# Altium schematic sheet ADCS.SchDoc
size A2 portrait; SheetNumber: 1; SheetTotal: 1
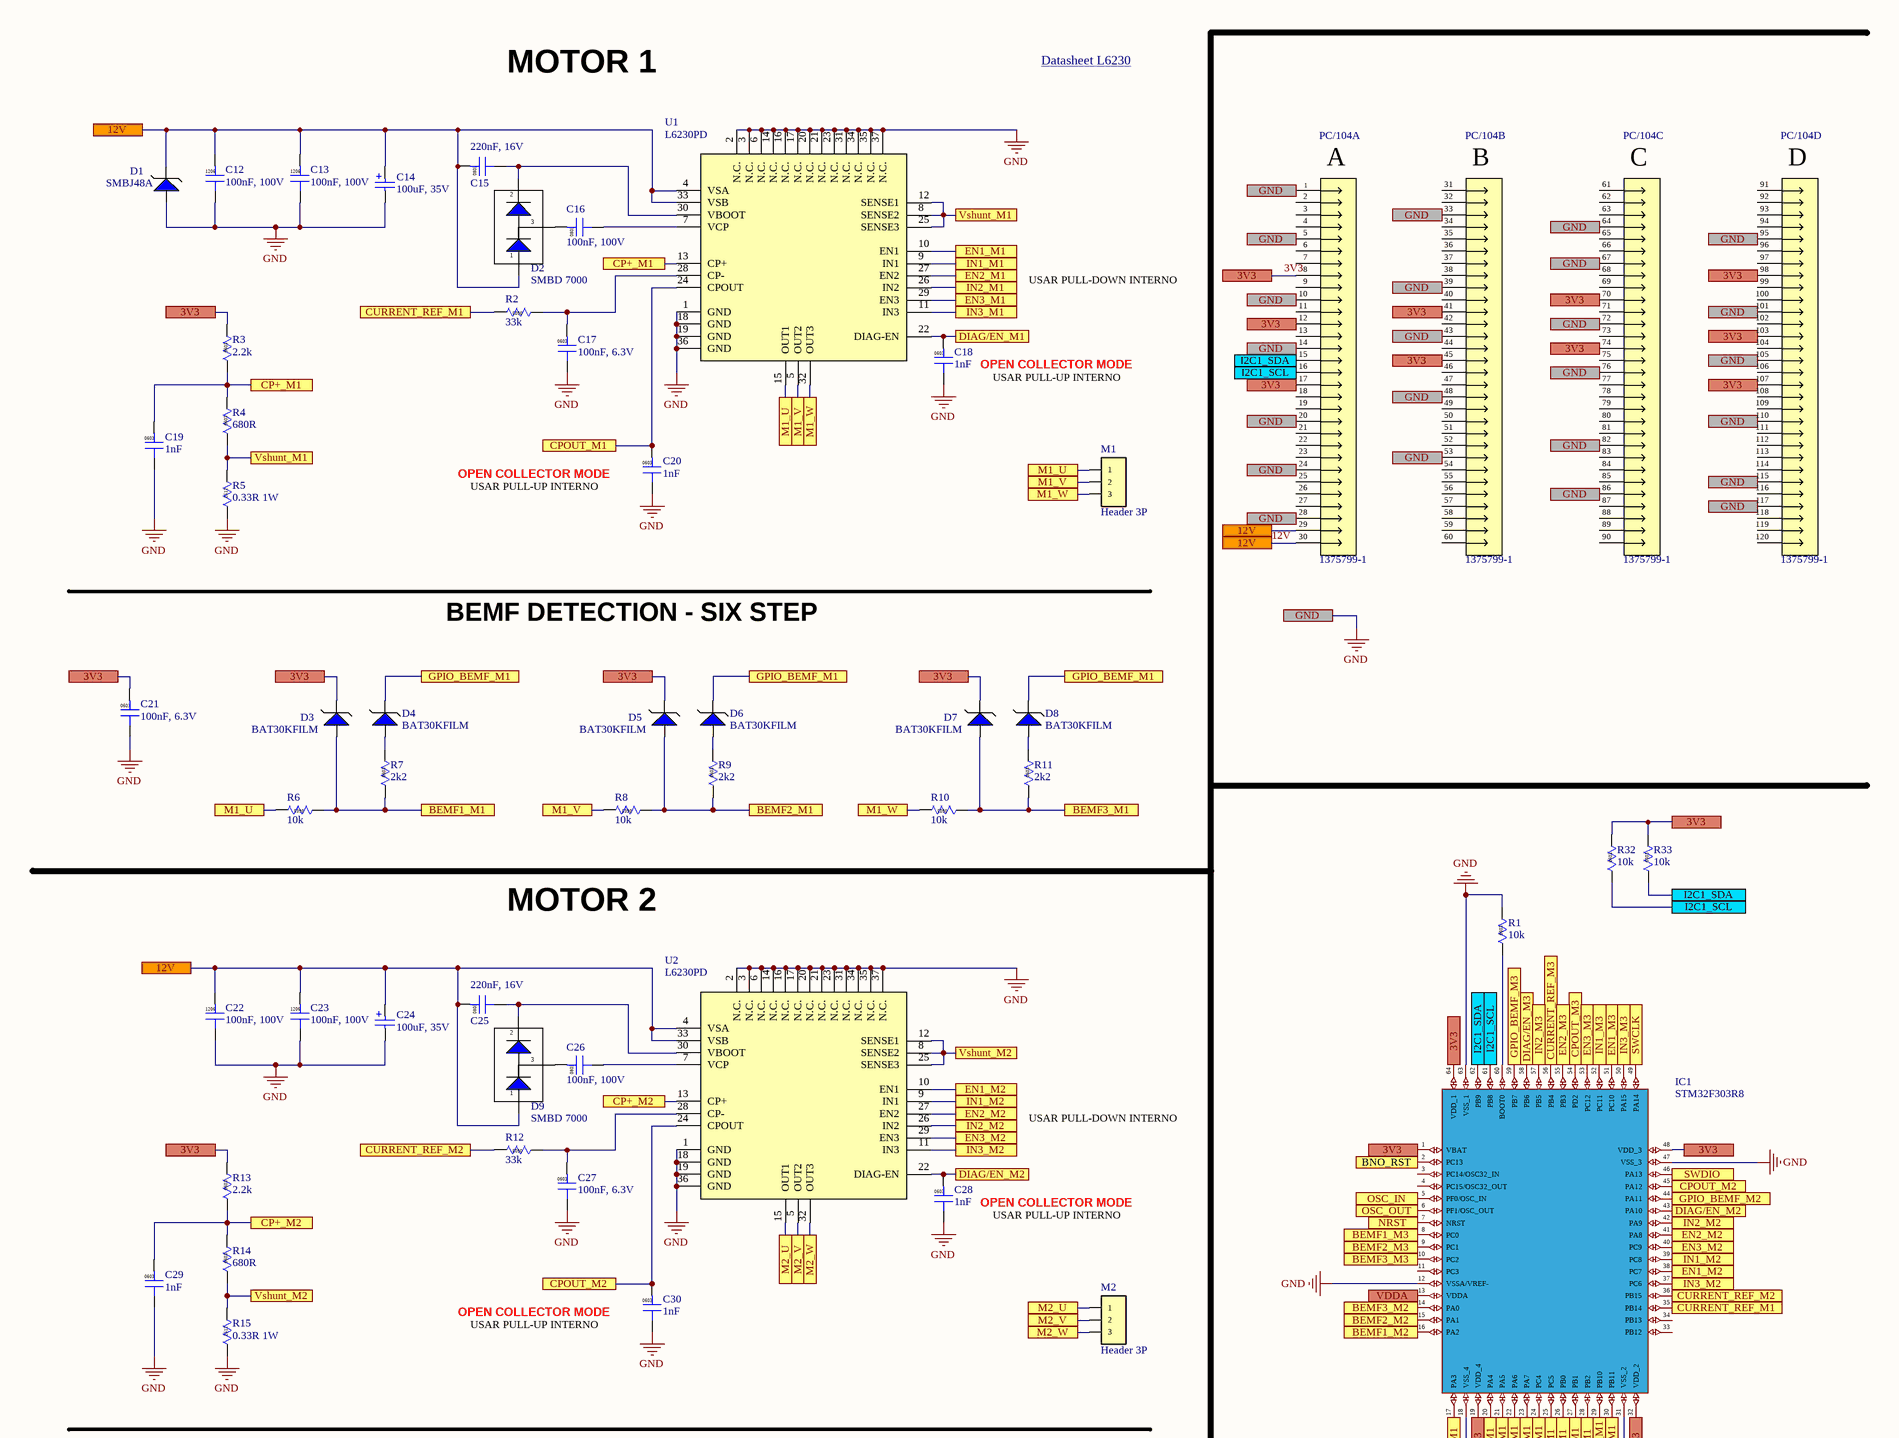
[diagram p0: ADCS.SchDoc, top]
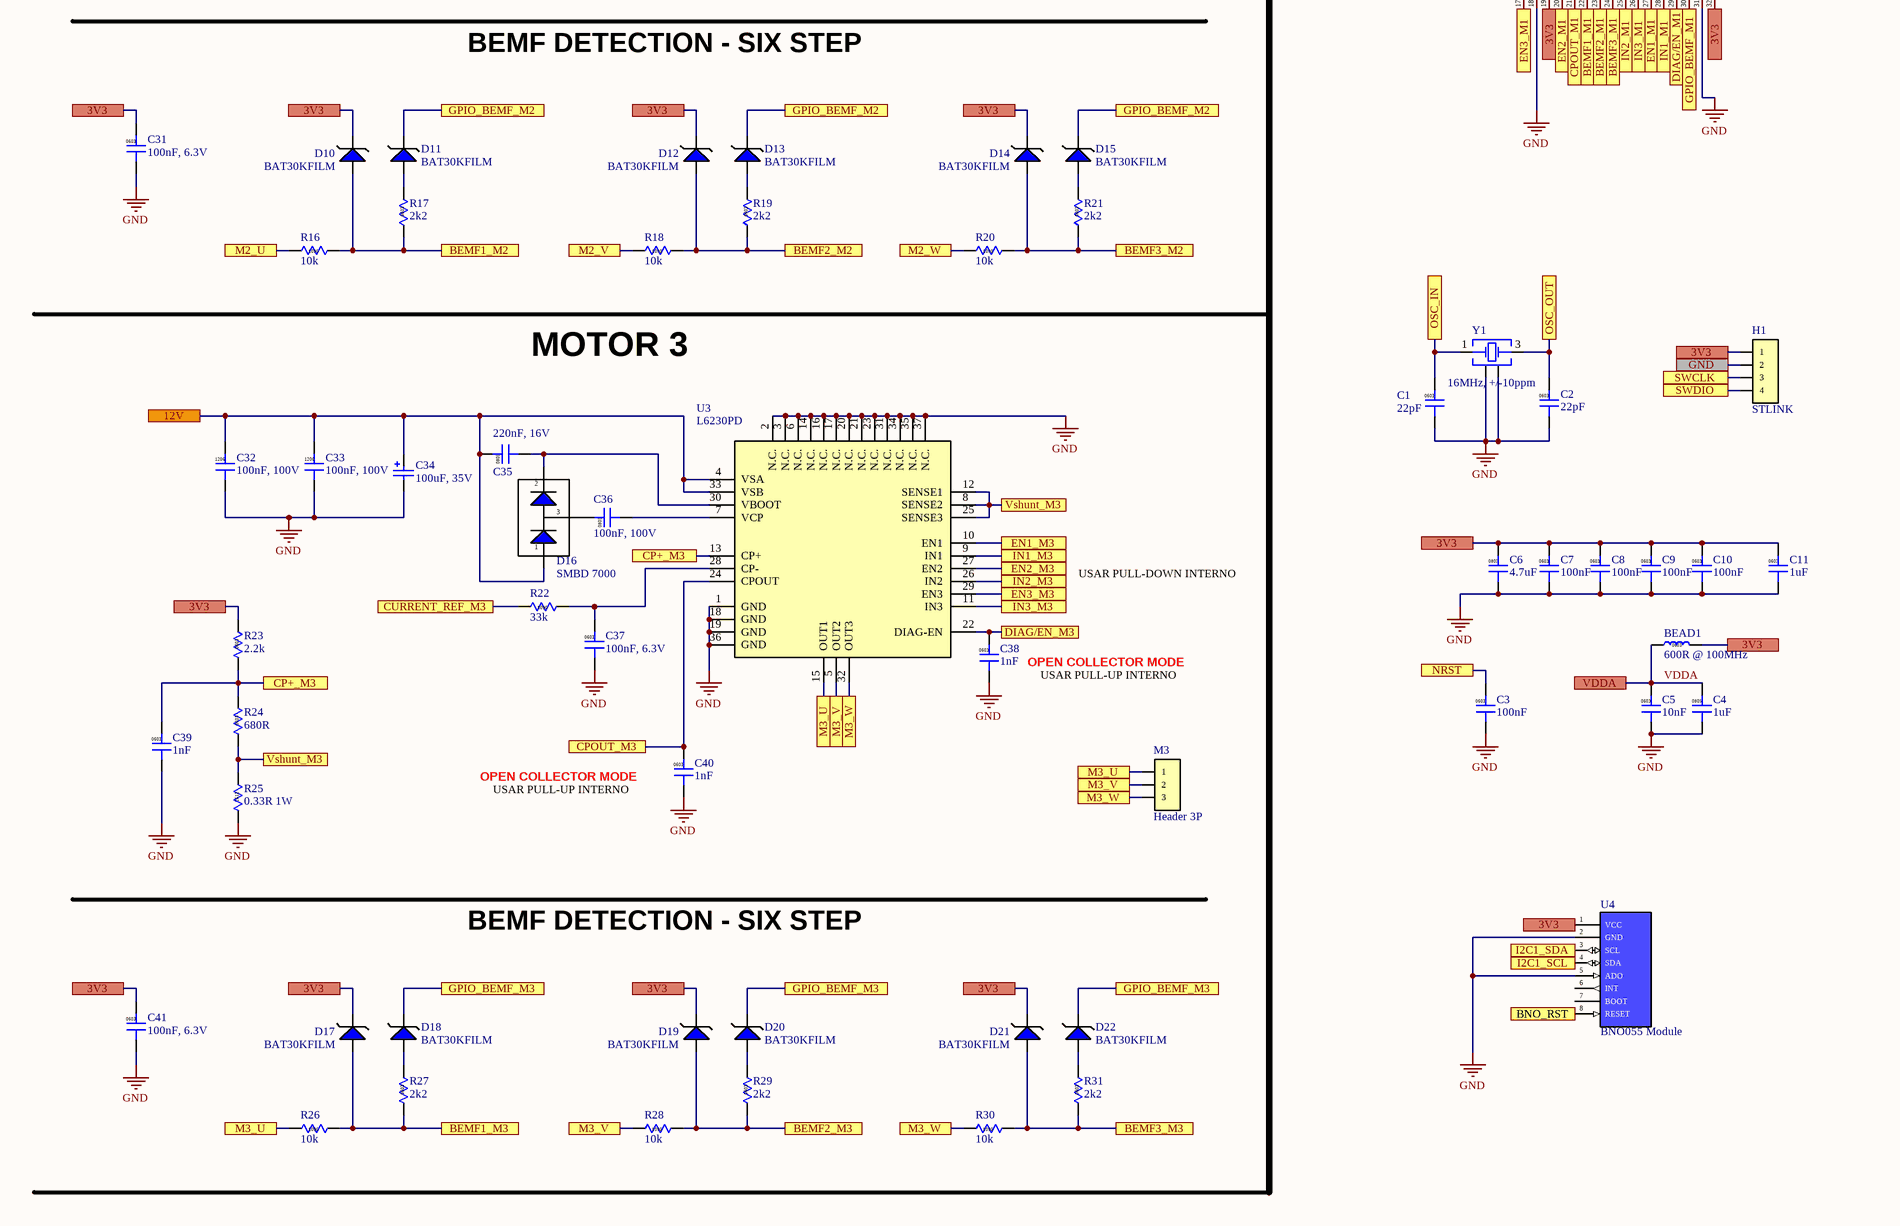
[diagram p1: ADCS.SchDoc, bottom]

## Parts
BEAD1  600R @ 100MHz  [IND0603]
C1  22pF  [CAP0603_060]
C2  22pF  [CAP0603_060]
C3  100nF  [CAP0603_060]
C4  1uF  [CAP0805_085]
C5  10nF  [CAP0603_040]
C6  4.7uF  [CAP0805_125]
C7  100nF  [CAP0603_060]
C8  100nF  [CAP0603_060]
C9  100nF  [CAP0603_060]
C10  100nF  [CAP0603_060]
C11  1uF  [CAP0603_090]
C12  100nF, 100V  [CAP1206_090]
C13  100nF, 100V  [CAP1206_090]
C14  100uF, 35V  [WCAP-ASLI_6.3x7.7]
C15  220nF, 16V  [CAP0805_085]
C16  100nF, 100V  [CAP0805_085]
C17  100nF, 6.3V  [CAP0603_060]
C18  1nF  [CAP0603_060]
C19  1nF  [CAP0603_060]
C20  1nF  [CAP0603_060]
C21  100nF, 6.3V  [CAP0603_060]
C22  100nF, 100V  [CAP1206_090]
C23  100nF, 100V  [CAP1206_090]
C24  100uF, 35V  [WCAP-ASLI_6.3x7.7]
C25  220nF, 16V  [CAP0805_085]
C26  100nF, 100V  [CAP0805_085]
C27  100nF, 6.3V  [CAP0603_060]
C28  1nF  [CAP0603_060]
C29  1nF  [CAP0603_060]
C30  1nF  [CAP0603_060]
C31  100nF, 6.3V  [CAP0603_060]
C32  100nF, 100V  [CAP1206_090]
C33  100nF, 100V  [CAP1206_090]
C34  100uF, 35V  [WCAP-ASLI_6.3x7.7]
C35  220nF, 16V  [CAP0805_085]
C36  100nF, 100V  [CAP0805_085]
C37  100nF, 6.3V  [CAP0603_060]
C38  1nF  [CAP0603_060]
C39  1nF  [CAP0603_060]
C40  1nF  [CAP0603_060]
C41  100nF, 6.3V  [CAP0603_060]
D1  SMBJ48A  [DO-214AA]
D2  SMBD 7000  [SOT-23]
D3  BAT30KFILM  [SOD-523]
D4  BAT30KFILM  [SOD-523]
D5  BAT30KFILM  [SOD-523]
D6  BAT30KFILM  [SOD-523]
D7  BAT30KFILM  [SOD-523]
D8  BAT30KFILM  [SOD-523]
D9  SMBD 7000  [SOT-23]
D10  BAT30KFILM  [SOD-523]
D11  BAT30KFILM  [SOD-523]
D12  BAT30KFILM  [SOD-523]
D13  BAT30KFILM  [SOD-523]
D14  BAT30KFILM  [SOD-523]
D15  BAT30KFILM  [SOD-523]
D16  SMBD 7000  [SOT-23]
D17  BAT30KFILM  [SOD-523]
D18  BAT30KFILM  [SOD-523]
D19  BAT30KFILM  [SOD-523]
D20  BAT30KFILM  [SOD-523]
D21  BAT30KFILM  [SOD-523]
D22  BAT30KFILM  [SOD-523]
H1  STLINK  [Header-4P-90]
IC1  STM32F303R8  [LQFP-64-10X10X5]
M1  Header 3P  [Header-3P]
M2  Header 3P  [Header-3P]
M3  Header 3P  [Header-3P]
PC/104  1375799-1  [1375799-1]  (parts A,B,C,D of 4)
R1  10k  [RES0603]
R2  33k  [RES0603]
R3  2.2k  [RES0603]
R4  680R  [RES0603]
R5  0.33R 1W  [RES2512]
R6  10k  [RES0603]
R7  2k2  [RES0603]
R8  10k  [RES0603]
R9  2k2  [RES0603]
R10  10k  [RES0603]
R11  2k2  [RES0603]
R12  33k  [RES0603]
R13  2.2k  [RES0603]
R14  680R  [RES0603]
R15  0.33R 1W  [RES2512]
R16  10k  [RES0603]
R17  2k2  [RES0603]
R18  10k  [RES0603]
R19  2k2  [RES0603]
R20  10k  [RES0603]
R21  2k2  [RES0603]
R22  33k  [RES0603]
R23  2.2k  [RES0603]
R24  680R  [RES0603]
R25  0.33R 1W  [RES2512]
R26  10k  [RES0603]
R27  2k2  [RES0603]
R28  10k  [RES0603]
R29  2k2  [RES0603]
R30  10k  [RES0603]
R31  2k2  [RES0603]
R32  10k  [RES0603]
R33  10k  [RES0603]
U1  L6230PD  [SOP65P1420X360-37N]
U2  L6230PD  [SOP65P1420X360-37N]
U3  L6230PD  [SOP65P1420X360-37N]
U4  BNO055 Module  [BNO055_M_TH]
Y1  16MHz, +/-10ppm  [WE-XTAL_CFPX-180]

## Ports
3V3, 12V, BEMF1_M1, BEMF1_M2, BEMF1_M3, BEMF2_M1, BEMF2_M2, BEMF2_M3, BEMF3_M1, BEMF3_M2, BEMF3_M3, BNO_RST, CP+_M1, CP+_M2, CP+_M3, CPOUT_M1, CPOUT_M2, CPOUT_M3, CURRENT_REF_M1, CURRENT_REF_M2, CURRENT_REF_M3, DIAG/EN_M1, DIAG/EN_M2, DIAG/EN_M3, EN1_M1, EN1_M2, EN1_M3, EN2_M1, EN2_M2, EN2_M3, EN3_M1, EN3_M2, EN3_M3, GND, GPIO_BEMF_M1, GPIO_BEMF_M2, GPIO_BEMF_M3, I2C1_SCL, I2C1_SDA, IN1_M1, IN1_M2, IN1_M3, IN2_M1, IN2_M2, IN2_M3, IN3_M1, IN3_M2, IN3_M3, M1_U, M1_V, M1_W, M2_U, M2_V, M2_W, M3_U, M3_V, M3_W, NRST, OSC_IN, OSC_OUT, SWCLK, SWDIO, VDDA, Vshunt_M1, Vshunt_M2, Vshunt_M3

## Nets
GND: C1.2 C2.2 C3.2 C4.2 C5.2 C6.2 C7.2 C8.2 C9.2 C10.2 C11.2 C12.2 C13.2 C14.1(N) C17.2 C18.2 C19.2 C20.2 C21.2 C22.2 C23.2 C24.1(N) C27.2 C28.2 C29.2 C30.2 C31.2 C32.2 C33.2 C34.1(N) C37.2 C38.2 C39.2 C40.2 C41.2 D1.1 H1.2 IC1.12(VSSA/VREF-) IC1.18(VSS_4) IC1.31(VSS_2) IC1.47(VSS_3) IC1.63(VSS_1) PC/104.1 PC/104.5 PC/104.10 PC/104.14 PC/104.20 PC/104.24 PC/104.28 PC/104.33 PC/104.39 PC/104.43 PC/104.48 PC/104.53 PC/104.64 PC/104.67 PC/104.72 PC/104.76 PC/104.82 PC/104.86 PC/104.95 PC/104.101 PC/104.105 PC/104.110 PC/104.115 PC/104.117 R1.2 R5.1 R15.1 R25.1 U1.1(GND) U1.2(N.C.) U1.3(N.C.) U1.6(N.C.) U1.14(N.C.) U1.16(N.C.) U1.17(N.C.) U1.18(GND) U1.19(GND) U1.20(N.C.) U1.21(N.C.) U1.23(N.C.) U1.31(N.C.) U1.34(N.C.) U1.35(N.C.) U1.36(GND) U1.37(N.C.) U2.1(GND) U2.2(N.C.) U2.3(N.C.) U2.6(N.C.) U2.14(N.C.) U2.16(N.C.) U2.17(N.C.) U2.18(GND) U2.19(GND) U2.20(N.C.) U2.21(N.C.) U2.23(N.C.) U2.31(N.C.) U2.34(N.C.) U2.35(N.C.) U2.36(GND) U2.37(N.C.) U3.1(GND) U3.2(N.C.) U3.3(N.C.) U3.6(N.C.) U3.14(N.C.) U3.16(N.C.) U3.17(N.C.) U3.18(GND) U3.19(GND) U3.20(N.C.) U3.21(N.C.) U3.23(N.C.) U3.31(N.C.) U3.34(N.C.) U3.35(N.C.) U3.36(GND) U3.37(N.C.) U4.2(GND) U4.5(ADO) Y1.2(GND) Y1.4(GND) ; port GND
3V3: BEAD1.2 C6.1 C7.1 C8.1 C9.1 C10.1 C11.1 C21.1 C31.1 C41.1 D3.2 D5.2 D7.2 D10.2 D12.2 D14.2 D17.2 D19.2 D21.2 H1.1 IC1.1(VBAT) IC1.19(VDD_4) IC1.32(VDD_2) IC1.48(VDD_3) IC1.64(VDD_1) PC/104.8 PC/104.12 PC/104.17 PC/104.41 PC/104.45 PC/104.70 PC/104.74 PC/104.98 PC/104.103 PC/104.107 R3.2 R13.2 R23.2 R32.2 R33.2 U4.1(VCC) ; port 3V3
12V: C12.1 C13.1 C14.2(P) C15.1 C22.1 C23.1 C24.2(P) C25.1 C32.1 C33.1 C34.2(P) C35.1 D1.2 D2.1 D9.1 D16.1 PC/104.29 PC/104.30 U1.4(VSA) U1.33(VSB) U2.4(VSA) U2.33(VSB) U3.4(VSA) U3.33(VSB) ; port 12V
BEMF1_M1: D3.1 IC1.22(PA6) R6.1 R7.1 ; port BEMF1_M1
BEMF1_M2: D10.1 IC1.16(PA2) R16.1 R17.1 ; port BEMF1_M2
BEMF1_M3: D17.1 IC1.8(PC0) R26.1 R27.1 ; port BEMF1_M3
BEMF2_M1: D5.1 IC1.23(PA7) R8.1 R9.1 ; port BEMF2_M1
BEMF2_M2: D12.1 IC1.15(PA1) R18.1 R19.1 ; port BEMF2_M2
BEMF2_M3: D19.1 IC1.9(PC1) R28.1 R29.1 ; port BEMF2_M3
BEMF3_M1: D7.1 IC1.24(PC4) R10.1 R11.1 ; port BEMF3_M1
BEMF3_M2: D14.1 IC1.14(PA0) R20.1 R21.1 ; port BEMF3_M2
BEMF3_M3: D21.1 IC1.10(PC2) R30.1 R31.1 ; port BEMF3_M3
BNO_RST: IC1.2(PC13) U4.8(RESET) ; port BNO_RST
CP+_M1: C19.1 R3.1 R4.2 U1.13(CP+) ; port CP+_M1
CP+_M2: C29.1 R13.1 R14.2 U2.13(CP+) ; port CP+_M2
CP+_M3: C39.1 R23.1 R24.2 U3.13(CP+) ; port CP+_M3
CPOUT_M1: C20.1 IC1.21(PA5) U1.24(CPOUT) ; port CPOUT_M1
CPOUT_M2: C30.1 IC1.45(PA12) U2.24(CPOUT) ; port CPOUT_M2
CPOUT_M3: C40.1 IC1.54(PD2) U3.24(CPOUT) ; port CPOUT_M3
CURRENT_REF_M1: IC1.35(PB14) R2.2 ; port CURRENT_REF_M1
CURRENT_REF_M2: IC1.36(PB15) R12.2 ; port CURRENT_REF_M2
CURRENT_REF_M3: IC1.56(PB4) R22.2 ; port CURRENT_REF_M3
DIAG/EN_M1: C18.1 IC1.29(PB10) U1.22(DIAG-EN) ; port DIAG/EN_M1
DIAG/EN_M2: C28.1 IC1.43(PA10) U2.22(DIAG-EN) ; port DIAG/EN_M2
DIAG/EN_M3: C38.1 IC1.58(PB6) U3.22(DIAG-EN) ; port DIAG/EN_M3
EN1_M1: IC1.27(PB1) U1.10(EN1) ; port EN1_M1
EN1_M2: IC1.38(PC7) U2.10(EN1) ; port EN1_M2
EN1_M3: IC1.51(PC10) U3.10(EN1) ; port EN1_M3
EN2_M1: IC1.20(PA4) U1.27(EN2) ; port EN2_M1
EN2_M2: IC1.41(PA8) U2.27(EN2) ; port EN2_M2
EN2_M3: IC1.55(PB3) U3.27(EN2) ; port EN2_M3
EN3_M1: IC1.17(PA3) U1.29(EN3) ; port EN3_M1
EN3_M2: IC1.40(PC9) U2.29(EN3) ; port EN3_M2
EN3_M3: IC1.53(PC12) U3.29(EN3) ; port EN3_M3
GPIO_BEMF_M1: D4.2 D6.2 D8.2 IC1.30(PB11) ; port GPIO_BEMF_M1
GPIO_BEMF_M2: D11.2 D13.2 D15.2 IC1.44(PA11) ; port GPIO_BEMF_M2
GPIO_BEMF_M3: D18.2 D20.2 D22.2 IC1.59(PB7) ; port GPIO_BEMF_M3
I2C1_SCL: IC1.61(PB8) PC/104.16 R32.1 U4.4(SDA) ; port I2C1_SCL
I2C1_SDA: IC1.62(PB9) PC/104.15 R33.1 U4.3(SCL) ; port I2C1_SDA
IN1_M1: IC1.28(PB2) U1.9(IN1) ; port IN1_M1
IN1_M2: IC1.39(PC8) U2.9(IN1) ; port IN1_M2
IN1_M3: IC1.52(PC11) U3.9(IN1) ; port IN1_M3
IN2_M1: IC1.25(PC5) U1.26(IN2) ; port IN2_M1
IN2_M2: IC1.42(PA9) U2.26(IN2) ; port IN2_M2
IN2_M3: IC1.57(PB5) U3.26(IN2) ; port IN2_M3
IN3_M1: IC1.26(PB0) U1.11(IN3) ; port IN3_M1
IN3_M2: IC1.37(PC6) U2.11(IN3) ; port IN3_M2
IN3_M3: IC1.50(PA15) U3.11(IN3) ; port IN3_M3
M1_U: M1.1 R6.2 U1.15(OUT1) ; port M1_U
M1_V: M1.2 R8.2 U1.5(OUT2) ; port M1_V
M1_W: M1.3 R10.2 U1.32(OUT3) ; port M1_W
M2_U: M2.1 R16.2 U2.15(OUT1) ; port M2_U
M2_V: M2.2 R18.2 U2.5(OUT2) ; port M2_V
M2_W: M2.3 R20.2 U2.32(OUT3) ; port M2_W
M3_U: M3.1 R26.2 U3.15(OUT1) ; port M3_U
M3_V: M3.2 R28.2 U3.5(OUT2) ; port M3_V
M3_W: M3.3 R30.2 U3.32(OUT3) ; port M3_W
NRST: C3.1 IC1.7(NRST) ; port NRST
OSC_IN: C1.1 IC1.5(PF0/OSC_IN) Y1.1(Crystal) ; port OSC_IN
OSC_OUT: C2.1 IC1.6(PF1/OSC_OUT) Y1.3(Crystal) ; port OSC_OUT
SWCLK: H1.3 IC1.49(PA14) ; port SWCLK
SWDIO: H1.4 IC1.46(PA13) ; port SWDIO
VDDA: BEAD1.1 C4.1 C5.1 IC1.13(VDDA) ; port VDDA
Vshunt_M1: R4.1 R5.2 U1.8(SENSE2) U1.12(SENSE1) U1.25(SENSE3) ; port Vshunt_M1
Vshunt_M2: R14.1 R15.2 U2.8(SENSE2) U2.12(SENSE1) U2.25(SENSE3) ; port Vshunt_M2
Vshunt_M3: R24.1 R25.2 U3.8(SENSE2) U3.12(SENSE1) U3.25(SENSE3) ; port Vshunt_M3
NetC15_2: C15.2 D2.2 U1.30(VBOOT)
NetC16_1: C16.1 D2.3
NetC16_2: C16.2 U1.7(VCP)
NetC17_1: C17.1 R2.1 U1.28(CP-)
NetC25_2: C25.2 D9.2 U2.30(VBOOT)
NetC26_1: C26.1 D9.3
NetC26_2: C26.2 U2.7(VCP)
NetC27_1: C27.1 R12.1 U2.28(CP-)
NetC35_2: C35.2 D16.2 U3.30(VBOOT)
NetC36_1: C36.1 D16.3
NetC36_2: C36.2 U3.7(VCP)
NetC37_1: C37.1 R22.1 U3.28(CP-)
NetD4_1: D4.1 R7.2
NetD6_1: D6.1 R9.2
NetD8_1: D8.1 R11.2
NetD11_1: D11.1 R17.2
NetD13_1: D13.1 R19.2
NetD15_1: D15.1 R21.2
NetD18_1: D18.1 R27.2
NetD20_1: D20.1 R29.2
NetD22_1: D22.1 R31.2
NetIC1_60: IC1.60(BOOT0) R1.1

Not connected (* = marked no-connect by the designer): IC1 3(PC14/OSC32_IN) 4(PC15/OSC32_OUT) 11(PC3) 33(PB12) 34(PB13); PC/104 2 3 4 6 7 9 11 13 18 19 21 22 23 25 26 27 31 32 34 35 36 37 38 40 42 44 46 47 49 50 51 52 54 55 56 57 58 59 60 61 62 63 65 66 68 69 71 73 75 77 78 79 80 81 83 84 85 87 88 89 90 91 92 93 94 96 97 99 100 102 104 106 108 109 111 112 113 114 116 118 119 120; U4 6(INT) 7(BOOT)

## Notes on the sheet
- MOTOR 1
- Datasheet L6230 <https://www.st.com/resource/en/datasheet/l6230.pdf>
- USAR PULL-DOWN INTERNO
- (near C18) OPEN COLLECTOR MODE
- USAR PULL-UP INTERNO
- OPEN COLLECTOR MODE
- BEMF DETECTION - SIX STEP
- MOTOR 2
- (near C28) OPEN COLLECTOR MODE
- MOTOR 3
- (near C38) OPEN COLLECTOR MODE
- (in symbol 1375799-1, part A) A
- (in symbol 1375799-1, part B) B
- (in symbol 1375799-1, part C) C
- (in symbol 1375799-1, part D) D
- (in symbol CAP0603) 0603
- (in symbol CAP0805) 0805
- (in symbol CAP1206) 1206
- (in symbol IND0603) 0603
- (in symbol RES0603) 0603
- (in symbol RES2512) 2512

## Library data of the parts
BEAD1 = IND0603: Indutor SDM 0603
C1-C3 C5 C7-C11 C17-C21 C27-C31 C37-C41 = CAP0603: Capacitor SDM 0603
C4 C6 C15 C16 C25 C26 C35 C36 = CAP0805: Capacitor SDM 0805
C12 C13 C22 C23 C32 C33 = CAP1206: Capacitor SDM 1206
C14 C24 C34 = 865080545012: WCAP-ASLI Aluminum Electrolytic Capacitor, V-Chip, SMT, D6.3xH7.7mm, 100uF, 35V; Manufacturer: Wurth Elektronik; Dissipation Factor: 14%; Endurance: 2000h; Leakage Current: 35uA; Ripple Current: 300mA; Capacitance Tolerance: +/-20%; Rated Voltage: 35VDC; Technical Reference: ASED077101M035DVCTCB000; ComponentLink1Description: Manufacturer; ComponentLink1URL: http://www.we-online.de; ComponentLink2Description: Datasheet; ComponentLink2URL: https://www.we-online.com/catalog/datasheet/865080545012.pdf; Height: 7.7mm; Mounting Technology: SMT; Operating Temperature: -55 to +105degC; Packaging: Tape and Reel; Published Date: May 2020; Capacitance: 100uF; Diameter: 6.3mm; Manufacturer Part Number: 865080545012
D1 = SMBJ48A: The SMBJ series is designed specifically to protect / sensitive electronic equipment from voltage transients / induced by lightning and other transient voltage events.
D2 D9 D16 = SMBD7000: Silicon Switching Diode Array. / For high-speed switching applications.
D3-D8 D10-D15 D17-D22 = BAT30: The BAT30 series uses 30 V Schottky barrier / diodes encapsulated in SOD-523 or SOT-323 / packages. / This device is specially suited for switching mode / applications needing low forward voltage drop / diodes.
H1 = Header-4P: Header 4 Pinos
IC1 = STM32F302R: Mainstream Mixed signals MCUs Arm Cortex-M4 core with DSP and FPU, 128 Kbytes of Flash memory, 72 MHz CPU, MPU, CCM, 12-bit ADC 5 MSPS, PGA, comparators
M1-M3 = Header-3P: Header 3 Pinos
PC/104 = 1375799-1: AMPMODU PC/104, PC/104 Connectors, Board-to-Board, 120 Position, 2mm [.079in] Centerline, Printed Circuit Board, 3A Contact Current Rating (Max)
R1-R4 R6-R14 R16-R24 R26-R33 = RES0603: Resistor SMD 0603
R5 R15 R25 = RES2512
U1-U3 = L6230: DMOS driver for three-phase brushless DC motor
U4 = BNO055_M: Smart sensor combining accelerometer, gyroscope, magnetometer and orientation software. Euler angles, quaternion, rotation vector, etc.
Y1 = 830100965009: WE-XTAL Quartz Crystal, SMT, CFPX-180, 16MHz, +/-10ppm; Manufacturer: Wurth Elektronik; Frequency Stability: +/-20ppm; Load Capacitance: 16pF; ComponentLink1Description: Manufacturer; ComponentLink1URL: http://www.we-online.de; ComponentLink2Description: Datasheet; ComponentLink2URL: https://katalog.we-online.com/pbs/datasheet/830100965009.pdf; Operating Temperature: -40 to +85degC; Packaging: Tape and Reel; Manufacturer Part Number: 830100965009; Published Date: July 2020; Size: CFPX-180; Frequency: 16MHz; Frequency Tolerance: +/-10ppm; Mounting Technology: SMT